# Altium schematic sheet Voltage-measurement.SchDoc
size A4
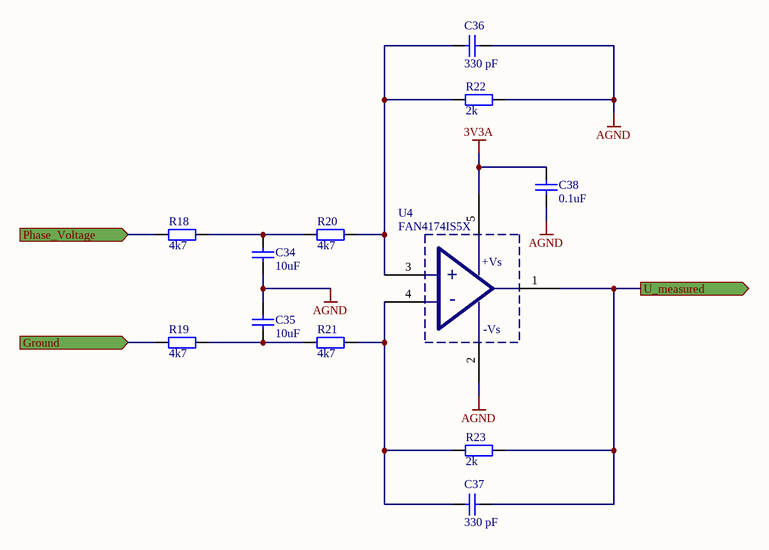
[diagram p0: Voltage-measurement.SchDoc]

## Parts
C34  10uF  [FP_0603_CAP_080]
C35  10uF  [FP_0603_CAP_080]
C36  330 pF  [FP_0603_CAP_080]
C37  330 pF  [FP_0603_CAP_080]
C38  0.1uF  [FP_0603_CAP_080]
R18  4k7  [FP_0603_RES]
R19  4k7  [FP_0603_RES]
R20  4k7  [FP_0603_RES]
R21  4k7  [FP_0603_RES]
R22  2k  [FP_0603_RES]
R23  2k  [FP_0603_RES]
U4  FAN4174IS5X  [SOT-23-5]

## Ports
Ground (in), Phase_Voltage (in), U_measured (out)

## Nets
3V3A: C38.1 U4.5(+Vs)
AGND: C34.2 C35.1 C36.2 C38.2 R22.2 U4.2(-Vs)
Ground: R19.1 ; port Ground
Phase_Voltage: R18.1 ; port Phase_Voltage
U_measured: C37.2 R23.2 U4.1(OUT) ; port U_measured
NetC34_1: C34.1 R18.2 R20.1
NetC35_2: C35.2 R19.2 R21.1
NetC36_1: C36.1 R20.2 R22.1 U4.3(+IN)
NetC37_1: C37.1 R21.2 R23.1 U4.4(-IN)

## Notes on the sheet
- (in symbol FAN4174IS5X) +; -

## Library data of the parts
C34-C38 = CAP: Capacitor
  C34 C35: Value: 10uF
  C36 C37: Value: 330 pF
  C38: Value: 0.1uF
R18-R23 = RES: Resistor
  R18-R21: Value: 4k7
  R22 R23: Value: 2k
U4 = FAN4174IS5X: OrderCode: 671-1166; CompType: FAN4174IS5X; Distributor: RS components; Package: SOT-23-5